# Altium schematic sheet Connector.SchDoc
size A4
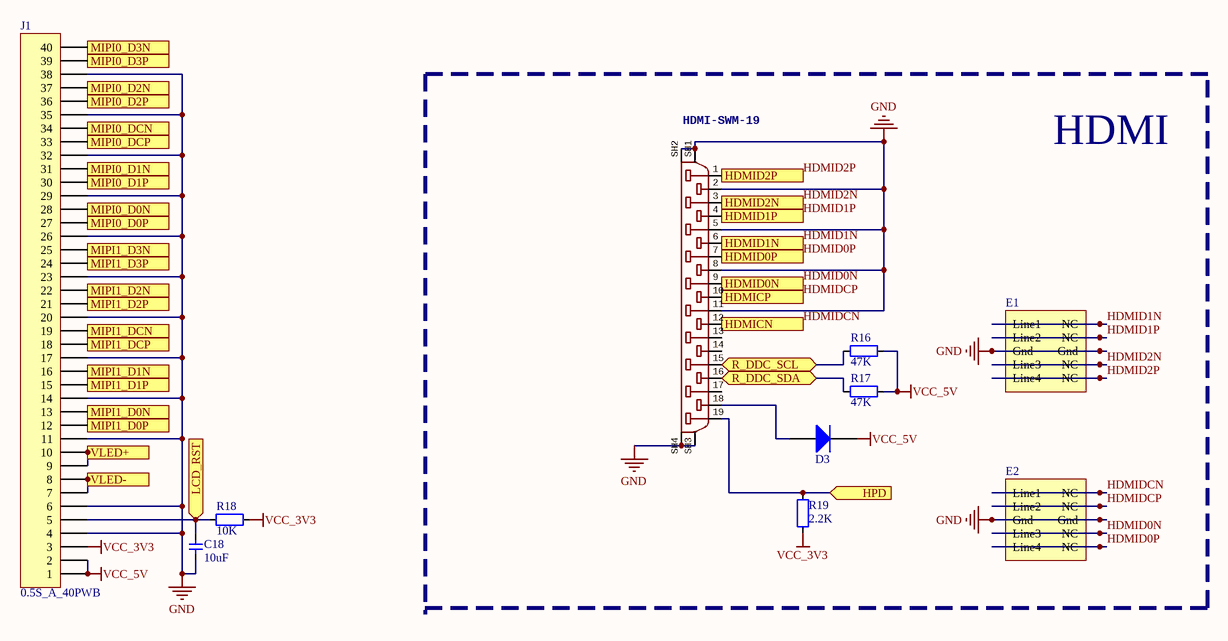
[diagram p0: Connector.SchDoc]

## Parts
C18  10uF  [CAP_0402]
D3  二极管-5B5817WS  [SOD-323]  (value not drawn)
E1  E?  [DFN-2510]  (value not drawn)
E2  E?  [DFN-2510]  (value not drawn)
HDMI?  HDMI-SWM-19  [HDMI-SWM-19]
J1  0.5S_A_40PWB  [FFC_0.5_40]
R16  47K  [RES_0402]
R17  47K  [RES_0402]
R18  10K  [RES_0402]
R19  2.2K  [RES_0402]

## Ports
HDMICN (out), HDMICP (out), HDMID0N (out), HDMID0P (out), HDMID1N (out), HDMID1P (out), HDMID2N (out), HDMID2P (out), HPD (in), LCD_RST (in), MIPI0_D0N (in), MIPI0_D0P (in), MIPI0_D1N (in), MIPI0_D1P (in), MIPI0_D2N (in), MIPI0_D2P (in), MIPI0_D3N (in), MIPI0_D3P (in), MIPI0_DCN (in), MIPI0_DCP (in), MIPI1_D0N (in), MIPI1_D0P (in), MIPI1_D1N (in), MIPI1_D1P (in), MIPI1_D2N (in), MIPI1_D2P (in), MIPI1_D3N (in), MIPI1_D3P (in), MIPI1_DCN (in), MIPI1_DCP (in), R_DDC_SCL (bidir), R_DDC_SDA (bidir), VLED+, VLED-

## Nets
GND: C18.1 E1.3(Gnd) E1.8(Gnd) E2.3(Gnd) E2.8(Gnd) HDMI?.2 HDMI?.5 HDMI?.8 HDMI?.11 HDMI?.SH1 HDMI?.SH2 HDMI?.SH3 HDMI?.SH4 J1.4 J1.6 J1.11 J1.14 J1.17 J1.20 J1.23 J1.26 J1.29 J1.32 J1.35 J1.38
VCC_3V3: J1.3 R18.2 R19.1
VCC_5V: D3.2(K) J1.1 J1.2 R16.2 R17.2
HDMID0N: E2.4(Line3) E2.7(NC) HDMI?.9 ; port HDMID0N
HDMID0P: E2.5(Line4) E2.6(NC) HDMI?.7 ; port HDMID0P
HDMID1N: E1.1(Line1) E1.10(NC) HDMI?.6 ; port HDMID1N
HDMID1P: E1.2(Line2) E1.9(NC) HDMI?.4 ; port HDMID1P
HDMID2N: E1.4(Line3) E1.7(NC) HDMI?.3 ; port HDMID2N
HDMID2P: E1.5(Line4) E1.6(NC) HDMI?.1 ; port HDMID2P
HDMIDCN: E2.1(Line1) E2.10(NC) HDMI?.12 ; port HDMICN
HDMIDCP: E2.2(Line2) E2.9(NC) HDMI?.10 ; port HDMICP
HPD: HDMI?.19 R19.2 ; port HPD
LCD_RST: C18.2 J1.5 R18.1 ; port LCD_RST
MIPI0_D0N: J1.28 ; port MIPI0_D0N
MIPI0_D0P: J1.27 ; port MIPI0_D0P
MIPI0_D1N: J1.31 ; port MIPI0_D1N
MIPI0_D1P: J1.30 ; port MIPI0_D1P
MIPI0_D2N: J1.37 ; port MIPI0_D2N
MIPI0_D2P: J1.36 ; port MIPI0_D2P
MIPI0_D3N: J1.40 ; port MIPI0_D3N
MIPI0_D3P: J1.39 ; port MIPI0_D3P
MIPI0_DCN: J1.34 ; port MIPI0_DCN
MIPI0_DCP: J1.33 ; port MIPI0_DCP
MIPI1_D0N: J1.13 ; port MIPI1_D0N
MIPI1_D0P: J1.12 ; port MIPI1_D0P
MIPI1_D1N: J1.16 ; port MIPI1_D1N
MIPI1_D1P: J1.15 ; port MIPI1_D1P
MIPI1_D2N: J1.22 ; port MIPI1_D2N
MIPI1_D2P: J1.21 ; port MIPI1_D2P
MIPI1_D3N: J1.25 ; port MIPI1_D3N
MIPI1_D3P: J1.24 ; port MIPI1_D3P
MIPI1_DCN: J1.19 ; port MIPI1_DCN
MIPI1_DCP: J1.18 ; port MIPI1_DCP
R_DDC_SCL: HDMI?.15 R16.1 ; port R_DDC_SCL
R_DDC_SDA: HDMI?.16 R17.1 ; port R_DDC_SDA
VLED+: J1.9 J1.10 ; port VLED+
VLED-: J1.7 J1.8 ; port VLED-
NetD3_1: D3.1(A) HDMI?.18

Not connected (* = marked no-connect by the designer): HDMI? 13 14 17

## Notes on the sheet
- HDMI

## Library data of the parts
C18 = 电容-0402: Capacitor; Value: 0.1u
D3 = 二极管-5B5817WS: 40V
E1 E2 = AZ1045-04F
HDMI? = HDMI-MC34931HDMI-SWM-19
J1 = FPC40-0.5mm: Header, 40-Pin; LatestRevisionDate: 17-Jul-2002; LatestRevisionNote: Re-released for DXP Platform.; Publisher: Altium Limited
R16-R19 = 电阻-0402: Resistor; Value: 22R